# Altium schematic sheet SNES TST Sheet3.SchDoc: SNES TST
size A4; DrawnBy: Opatus; DocumentNumber: 3; Revision: 0; SheetNumber: 3; SheetTotal: 5
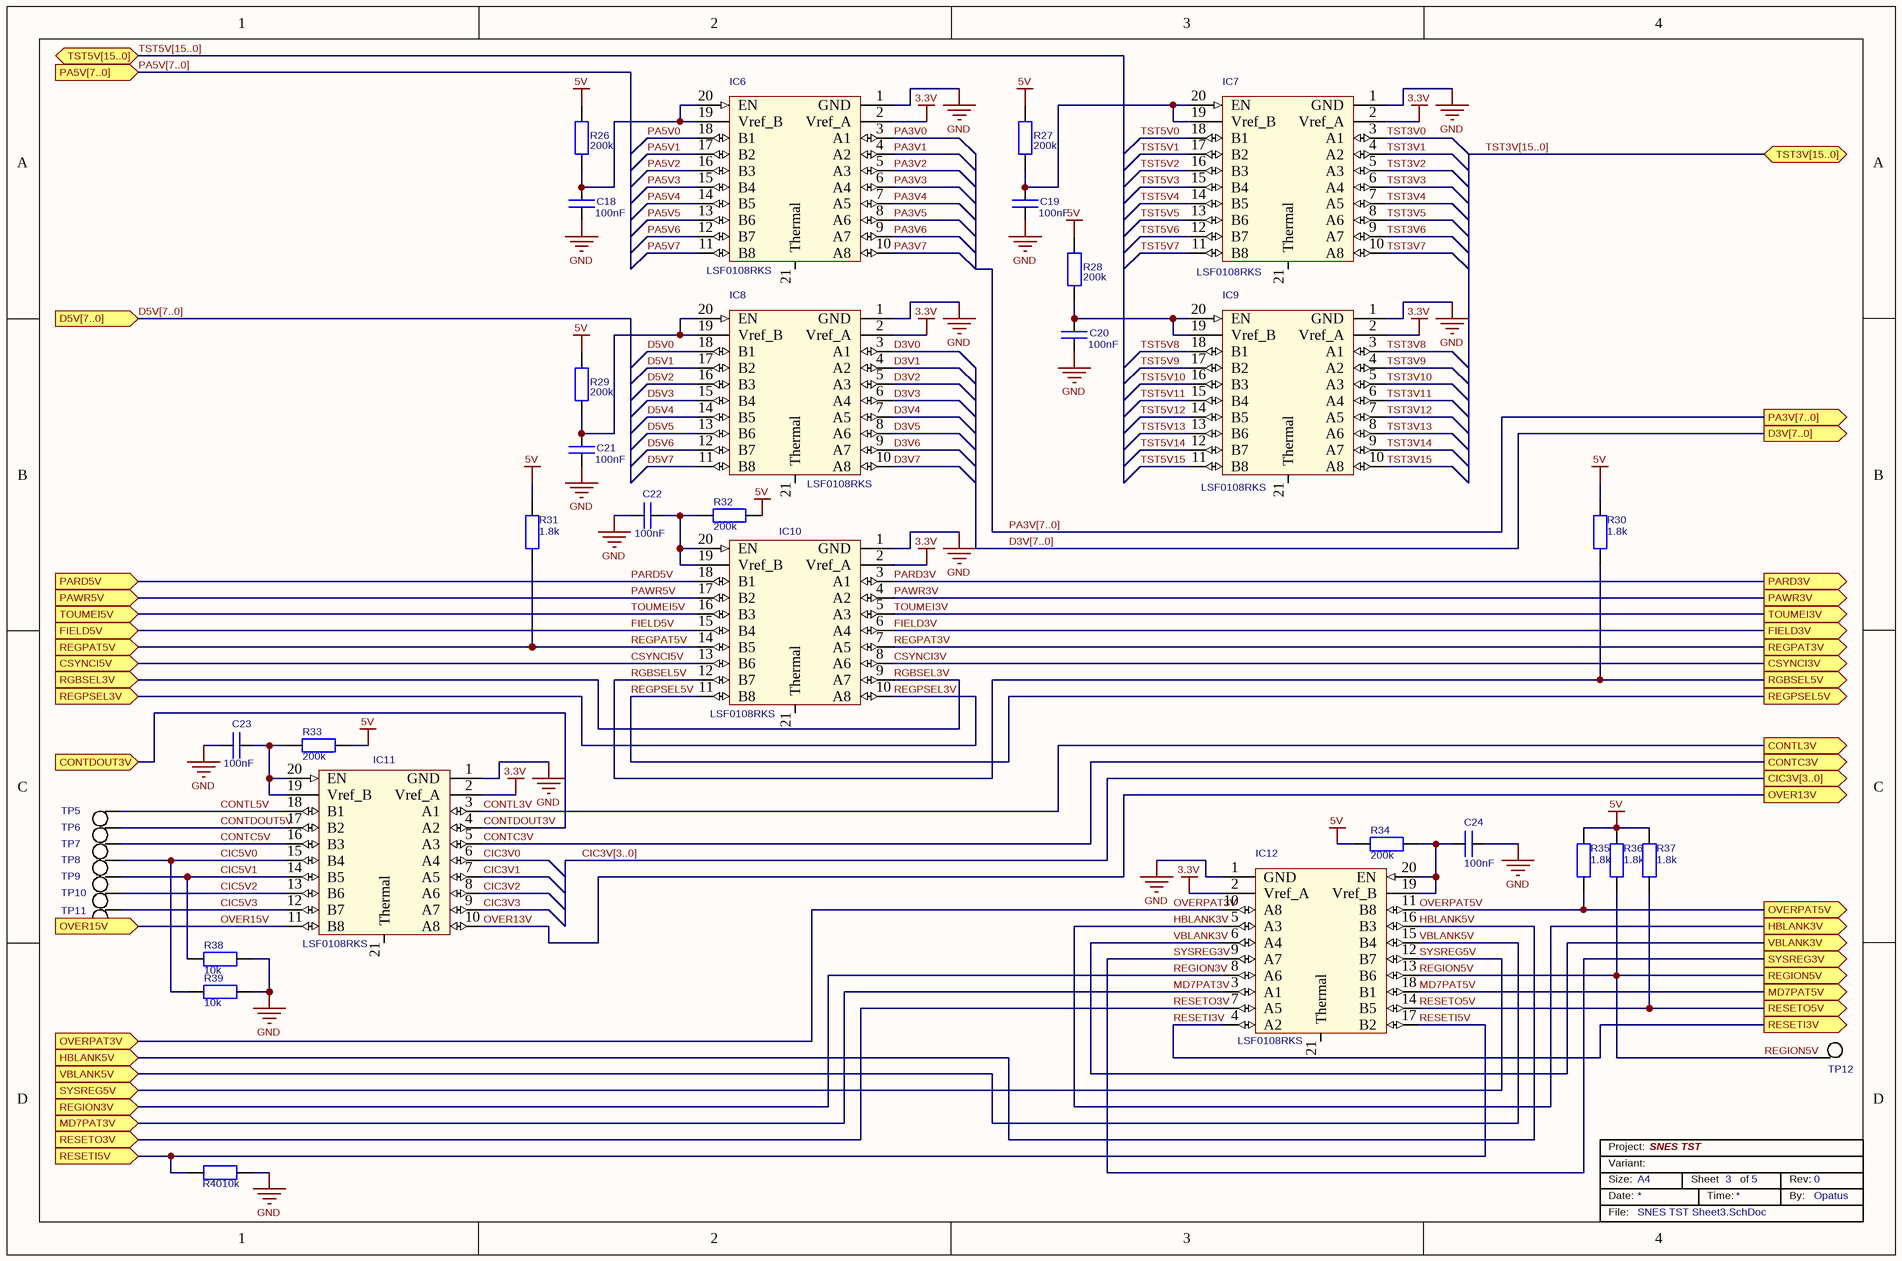
[diagram p0: SNES TST Sheet3.SchDoc]

## Parts
C18  value 100nF  [Cap_0402_Chip]  (hidden comment: Ceramic Capacitor 100nF 10V ±20% X7R 0402)
C19  value 100nF  [Cap_0402_Chip]  (hidden comment: Ceramic Capacitor 100nF 10V ±20% X7R 0402)
C20  value 100nF  [Cap_0402_Chip]  (hidden comment: Ceramic Capacitor 100nF 10V ±20% X7R 0402)
C21  value 100nF  [Cap_0402_Chip]  (hidden comment: Ceramic Capacitor 100nF 10V ±20% X7R 0402)
C22  value 100nF  [Cap_0402_Chip]  (hidden comment: Ceramic Capacitor 100nF 10V ±20% X7R 0402)
C23  value 100nF  [Cap_0402_Chip]  (hidden comment: Ceramic Capacitor 100nF 10V ±20% X7R 0402)
C24  value 100nF  [Cap_0402_Chip]  (hidden comment: Ceramic Capacitor 100nF 10V ±20% X7R 0402)
IC6  Manufacturer_Part_Number: LSF0108RKS  [VQFN20]  (hidden comment: LSF0108)
IC7  Manufacturer_Part_Number: LSF0108RKS  [VQFN20]  (hidden comment: LSF0108)
IC8  Manufacturer_Part_Number: LSF0108RKS  [VQFN20]  (hidden comment: LSF0108)
IC9  Manufacturer_Part_Number: LSF0108RKS  [VQFN20]  (hidden comment: LSF0108)
IC10  Manufacturer_Part_Number: LSF0108RKS  [VQFN20]  (hidden comment: LSF0108)
IC11  Manufacturer_Part_Number: LSF0108RKS  [VQFN20]  (hidden comment: LSF0108)
IC12  Manufacturer_Part_Number: LSF0108RKS  [VQFN20]  (hidden comment: LSF0108)
R26  value 200k  [Res_0402_Chip]  (hidden comment: Resistor 200k 0402 ±1%)
R27  value 200k  [Res_0402_Chip]  (hidden comment: Resistor 200k 0402 ±1%)
R28  value 200k  [Res_0402_Chip]  (hidden comment: Resistor 200k 0402 ±1%)
R29  value 200k  [Res_0402_Chip]  (hidden comment: Resistor 200k 0402 ±1%)
R30  value 1.8k  [Res_0402_Chip]  (hidden comment: Resistor 1.8k 0402 ±1%)
R31  value 1.8k  [Res_0402_Chip]  (hidden comment: Resistor 1.8k 0402 ±1%)
R32  value 200k  [Res_0402_Chip]  (hidden comment: Resistor 200k 0402 ±1%)
R33  value 200k  [Res_0402_Chip]  (hidden comment: Resistor 200k 0402 ±1%)
R34  value 200k  [Res_0402_Chip]  (hidden comment: Resistor 200k 0402 ±1%)
R35  value 1.8k  [Res_0402_Chip]  (hidden comment: Resistor 1.8k 0402 ±1%)
R36  value 1.8k  [Res_0402_Chip]  (hidden comment: Resistor 1.8k 0402 ±1%)
R37  value 1.8k  [Res_0402_Chip]  (hidden comment: Resistor 1.8k 0402 ±1%)
R38  value 10k  [Res_0402_Chip]  (hidden comment: Resistor 10k 0402 ±1%)
R39  value 10k  [Res_0402_Chip]  (hidden comment: Resistor 10k 0402 ±1%)
R40  value 10k  [Res_0402_Chip]  (hidden comment: Resistor 10k 0402 ±1%)
TP5  Pin Connector  [Pin Connector Small]  (value not drawn)  (no BOM)
TP6  Pin Connector  [Pin Connector Small]  (value not drawn)  (no BOM)
TP7  Pin Connector  [Pin Connector Small]  (value not drawn)  (no BOM)
TP8  Pin Connector  [Pin Connector Small]  (value not drawn)  (no BOM)
TP9  Pin Connector  [Pin Connector Small]  (value not drawn)  (no BOM)
TP10  Pin Connector  [Pin Connector Small]  (value not drawn)  (no BOM)
TP11  Pin Connector  [Pin Connector Small]  (value not drawn)  (no BOM)
TP12  Pin Connector  [Pin Connector Small]  (value not drawn)  (no BOM)

## Ports
CIC3V[3..0] (out), CONTC3V (out), CONTDOUT3V (in), CONTL3V (out), CSYNCI3V (out), CSYNCI5V (in), D3V[7..0] (out), D5V[7..0] (in), FIELD3V (out), FIELD5V (in), HBLANK3V (out), HBLANK5V (in), MD7PAT3V (in), MD7PAT5V (out), OVER13V (out), OVER15V (in), OVERPAT3V (in), OVERPAT5V (out), PA3V[7..0] (out), PA5V[7..0] (in), PARD3V (out), PARD5V (in), PAWR3V (out), PAWR5V (in), REGION3V (in), REGION5V (out), REGPAT3V (out), REGPAT5V (in), REGPSEL3V (in), REGPSEL5V (out), RESETI3V (out), RESETI5V (in), RESETO3V (in), RESETO5V (out), RGBSEL3V (in), RGBSEL5V (out), SYSREG3V (out), SYSREG5V (in), TOUMEI3V (out), TOUMEI5V (in), TST3V[15..0] (bidir), TST5V[15..0] (bidir), VBLANK3V (out), VBLANK5V (in)

## Nets
3.3V: IC6.2(Vref_A) IC7.2(Vref_A) IC8.2(Vref_A) IC9.2(Vref_A) IC10.2(Vref_A) IC11.2(Vref_A) IC12.2(Vref_A)
5V: R26.2 R27.2 R28.2 R29.2 R30.1 R31.1 R32.1 R33.1 R34.2 R35.1 R36.1 R37.1
GND: C18.2 C19.2 C20.2 C21.2 C22.1 C23.1 C24.2 IC6.1(GND) IC7.1(GND) IC8.1(GND) IC9.1(GND) IC10.1(GND) IC11.1(GND) IC12.1(GND) R38.1 R39.1 R40.2
CIC3V0: IC11.6(A4)
CIC3V1: IC11.7(A5)
CIC3V2: IC11.8(A6)
CIC3V3: IC11.9(A7)
CIC5V0: IC11.15(B4) R39.2 TP8.1
CIC5V1: IC11.14(B5) R38.2 TP9.1
CIC5V2: IC11.13(B6) TP10.1
CIC5V3: IC11.12(B7) TP11.1
CONTC3V: IC11.5(A3) ; port CONTC3V
CONTC5V: IC11.16(B3) TP7.1
CONTDOUT3V: IC11.4(A2) ; port CONTDOUT3V
CONTDOUT5V: IC11.17(B2) TP6.1
CONTL3V: IC11.3(A1) ; port CONTL3V
CONTL5V: IC11.18(B1) TP5.1
CSYNCI3V: IC10.8(A6) ; port CSYNCI3V
CSYNCI5V: IC10.13(B6) ; port CSYNCI5V
D3V0: IC8.3(A1)
D3V1: IC8.4(A2)
D3V2: IC8.5(A3)
D3V3: IC8.6(A4)
D3V4: IC8.7(A5)
D3V5: IC8.8(A6)
D3V6: IC8.9(A7)
D3V7: IC8.10(A8)
D5V0: IC8.18(B1)
D5V1: IC8.17(B2)
D5V2: IC8.16(B3)
D5V3: IC8.15(B4)
D5V4: IC8.14(B5)
D5V5: IC8.13(B6)
D5V6: IC8.12(B7)
D5V7: IC8.11(B8)
FIELD3V: IC10.6(A4) ; port FIELD3V
FIELD5V: IC10.15(B4) ; port FIELD5V
HBLANK3V: IC12.5(A3) ; port HBLANK3V
HBLANK5V: IC12.16(B3) ; port HBLANK5V
MD7PAT3V: IC12.3(A1) ; port MD7PAT3V
MD7PAT5V: IC12.18(B1) ; port MD7PAT5V
OVER13V: IC11.10(A8) ; port OVER13V
OVER15V: IC11.11(B8) ; port OVER15V
OVERPAT3V: IC12.10(A8) ; port OVERPAT3V
OVERPAT5V: IC12.11(B8) R35.2 ; port OVERPAT5V
PA3V0: IC6.3(A1)
PA3V1: IC6.4(A2)
PA3V2: IC6.5(A3)
PA3V3: IC6.6(A4)
PA3V4: IC6.7(A5)
PA3V5: IC6.8(A6)
PA3V6: IC6.9(A7)
PA3V7: IC6.10(A8)
PA5V0: IC6.18(B1)
PA5V1: IC6.17(B2)
PA5V2: IC6.16(B3)
PA5V3: IC6.15(B4)
PA5V4: IC6.14(B5)
PA5V5: IC6.13(B6)
PA5V6: IC6.12(B7)
PA5V7: IC6.11(B8)
PARD3V: IC10.3(A1) ; port PARD3V
PARD5V: IC10.18(B1) ; port PARD5V
PAWR3V: IC10.4(A2) ; port PAWR3V
PAWR5V: IC10.17(B2) ; port PAWR5V
REGION3V: IC12.8(A6) ; port REGION3V
REGION5V: IC12.13(B6) R36.2 TP12.1 ; port REGION5V
REGPAT3V: IC10.7(A5) ; port REGPAT3V
REGPAT5V: IC10.14(B5) R31.2 ; port REGPAT5V
REGPSEL3V: IC10.10(A8) ; port REGPSEL3V
REGPSEL5V: IC10.11(B8) ; port REGPSEL5V
RESETI3V: IC12.4(A2) ; port RESETI3V
RESETI5V: IC12.17(B2) R40.1 ; port RESETI5V
RESETO3V: IC12.7(A5) ; port RESETO3V
RESETO5V: IC12.14(B5) R37.2 ; port RESETO5V
RGBSEL3V: IC10.9(A7) ; port RGBSEL3V
RGBSEL5V: IC10.12(B7) R30.2 ; port RGBSEL5V
SYSREG3V: IC12.9(A7) ; port SYSREG3V
SYSREG5V: IC12.12(B7) ; port SYSREG5V
TOUMEI3V: IC10.5(A3) ; port TOUMEI3V
TOUMEI5V: IC10.16(B3) ; port TOUMEI5V
TST3V0: IC7.3(A1)
TST3V1: IC7.4(A2)
TST3V2: IC7.5(A3)
TST3V3: IC7.6(A4)
TST3V4: IC7.7(A5)
TST3V5: IC7.8(A6)
TST3V6: IC7.9(A7)
TST3V7: IC7.10(A8)
TST3V8: IC9.3(A1)
TST3V9: IC9.4(A2)
TST3V10: IC9.5(A3)
TST3V11: IC9.6(A4)
TST3V12: IC9.7(A5)
TST3V13: IC9.8(A6)
TST3V14: IC9.9(A7)
TST3V15: IC9.10(A8)
TST5V0: IC7.18(B1)
TST5V1: IC7.17(B2)
TST5V2: IC7.16(B3)
TST5V3: IC7.15(B4)
TST5V4: IC7.14(B5)
TST5V5: IC7.13(B6)
TST5V6: IC7.12(B7)
TST5V7: IC7.11(B8)
TST5V8: IC9.18(B1)
TST5V9: IC9.17(B2)
TST5V10: IC9.16(B3)
TST5V11: IC9.15(B4)
TST5V12: IC9.14(B5)
TST5V13: IC9.13(B6)
TST5V14: IC9.12(B7)
TST5V15: IC9.11(B8)
VBLANK3V: IC12.6(A4) ; port VBLANK3V
VBLANK5V: IC12.15(B4) ; port VBLANK5V
NetC18_1: C18.1 IC6.19(Vref_B) IC6.20(EN) R26.1
NetC19_1: C19.1 IC7.19(Vref_B) IC7.20(EN) R27.1
NetC20_1: C20.1 IC9.19(Vref_B) IC9.20(EN) R28.1
NetC21_1: C21.1 IC8.19(Vref_B) IC8.20(EN) R29.1
NetC22_2: C22.2 IC10.19(Vref_B) IC10.20(EN) R32.2
NetC23_2: C23.2 IC11.19(Vref_B) IC11.20(EN) R33.2
NetC24_1: C24.1 IC12.19(Vref_B) IC12.20(EN) R34.1

Not connected (* = marked no-connect by the designer): IC6 21(Thermal); IC7 21(Thermal); IC8 21(Thermal); IC9 21(Thermal); IC10 21(Thermal); IC11 21(Thermal); IC12 21(Thermal)

## Buses and harness runs
bus CIC3V[3..0] = port CIC3V[3..0]
bus D3V[7..0] = port D3V[7..0]
bus D5V[7..0] = port D5V[7..0]
bus PA3V[7..0] = port PA3V[7..0]
bus PA5V[7..0] = port PA5V[7..0]
bus TST3V[15..0] = port TST3V[15..0]
bus TST5V[15..0] = port TST5V[15..0]

## Notes on the sheet
- Size:
- Date:
- Variant:
- Project:
- A4
- Sheet
- Time:
- of
- Rev:
- By:
- File:

## Library data of the parts
C18-C24 = Capacitor: ChipSize: 0402; NominalVoltage: 10V; Dielectric: X7R; Tolerance: ±20%; PartType: Ceramic Capacitor
IC6-IC12 = LSF0108DCUR: 8-bit level shifter; Vendor: Texas Instruments
R26-R40 = R: ChipSize: 0402; Tolerance: ±1%; PartType: Resistor